# Altium schematic sheet ethernet.SchDoc
size A3
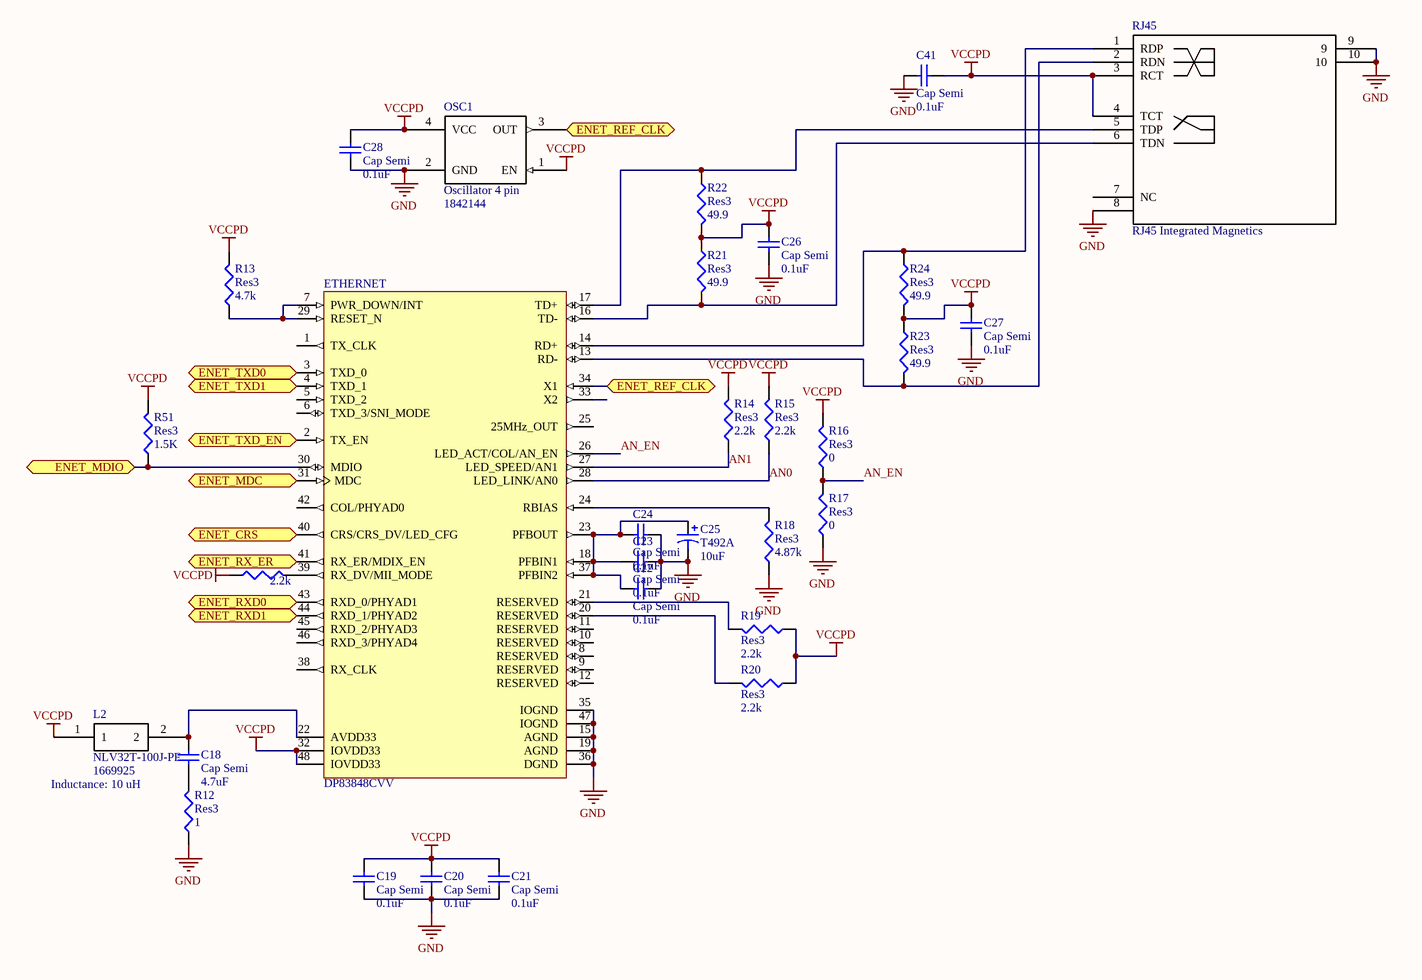
[diagram p0: ethernet.SchDoc]

## Parts
C18  Cap Semi  value 4.7uF  [CAPC1608L]
C19  Cap Semi  value 0.1uF  [CAPC1608L]
C20  Cap Semi  value 0.1uF  [CAPC1608L]
C21  Cap Semi  value 0.1uF  [CAPC1608L]
C22  Cap Semi  value 0.1uF  [CAPC1608L]
C23  Cap Semi  value 0.1uF  [CAPC1608L]
C24  Cap Semi  value 0.1uF  [CAPC1608L]
C25  T492A  value 10uF  [A]
C26  Cap Semi  value 0.1uF  [CAPC1608L]
C27  Cap Semi  value 0.1uF  [CAPC1608L]
C28  Cap Semi  value 0.1uF  [CAPC1608L]
C41  Cap Semi  value 0.1uF  [CAPC1608L]
ETHERNET  DP83848CVV  [VBH48A_N]
L2  NLV32T-100J-PF  Supplier Part Number 1: 1669925  Inductance: 10 uH  [INDC3225X22N]
OSC1  Oscillator 4 pin  Supplier Part Number 1: 1842144  [SMD Crystal 7x5 mm]
R12  Res3  value 1  [RESC1608L]
R13  Res3  value 4.7k  [RESC1608L]
R14  Res3  value 2.2k  [RESC1608L]
R15  Res3  value 2.2k  [RESC1608L]
R16  Res3  value 0  [RESC1608L]
R17  Res3  value 0  [RESC1608L]
R18  Res3  value 4.87k  [RESC1608L]
R19  Res3  value 2.2k  [RESC1608L]
R20  Res3  value 2.2k  [RESC1608L]
R21  Res3  value 49.9  [RESC1608L]
R22  Res3  value 49.9  [RESC1608L]
R23  Res3  value 49.9  [RESC1608L]
R24  Res3  value 49.9  [RESC1608L]
R33  value 2.2k  [RESC1608L]
R51  Res3  value 1.5K  [RESC1608L]
RJ45  RJ45 Integrated Magnetics  [RJ45]

## Ports
ENET_CRS, ENET_MDC, ENET_MDIO, ENET_REF_CLK, ENET_RX_ER, ENET_RXD0, ENET_RXD1, ENET_TXD0, ENET_TXD1, ENET_TXD_EN

## Nets
GND: C19.2 C20.2 C21.2 C22.2 C23.2 C24.2 C25.2 C26.1 C27.1 C28.2 C41.1 ETHERNET.15(AGND) ETHERNET.19(AGND) ETHERNET.35(IOGND) ETHERNET.36(DGND) ETHERNET.47(IOGND) OSC1.2(GND) R12.1 R17.1 R18.1 RJ45.8 RJ45.9 RJ45.10
VCCPD: C19.1 C20.1 C21.1 C26.2 C27.2 C28.1 C41.2 ETHERNET.32(IOVDD33) ETHERNET.48(IOVDD33) L2.1 OSC1.1(EN) OSC1.4(VCC) R13.2 R14.2 R15.2 R16.2 R19.1 R20.1 R21.1 R22.2 R23.1 R24.2 R33.1 R51.2 RJ45.3(RCT) RJ45.4(TCT)
AN0: ETHERNET.28(LED_LINK/AN0) R15.1
AN1: ETHERNET.27(LED_SPEED/AN1) R14.1
AN_EN: ETHERNET.26(LED_ACT/COL/AN_EN) R16.1 R17.2
ENET_CRS: ETHERNET.40(CRS/CRS_DV/LED_CFG) ; port ENET_CRS
ENET_MDC: ETHERNET.31(MDC) ; port ENET_MDC
ENET_MDIO: ETHERNET.30(MDIO) R51.1 ; port ENET_MDIO
ENET_REF_CLK: ETHERNET.34(X1) OSC1.3(OUT) ; port ENET_REF_CLK
ENET_RX_ER: ETHERNET.41(RX_ER/MDIX_EN) ; port ENET_RX_ER
ENET_RXD0: ETHERNET.43(RXD_0/PHYAD1) ; port ENET_RXD0
ENET_RXD1: ETHERNET.44(RXD_1/PHYAD2) ; port ENET_RXD1
ENET_TXD0: ETHERNET.3(TXD_0) ; port ENET_TXD0
ENET_TXD1: ETHERNET.4(TXD_1) ; port ENET_TXD1
ENET_TXD_EN: ETHERNET.2(TX_EN) ; port ENET_TXD_EN
NetC18_1: C18.1 ETHERNET.22(AVDD33) L2.2
NetC18_2: C18.2 R12.2
NetC22_1: C22.1 C23.1 C24.1 C25.1 ETHERNET.18(PFBIN1) ETHERNET.23(PFBOUT) ETHERNET.37(PFBIN2)
NetETHERNET_7: ETHERNET.7(PWR_DOWN/INT) ETHERNET.29(RESET_N) R13.1
NetETHERNET_13: ETHERNET.13(RD-) R23.2 RJ45.2(RDN)
NetETHERNET_14: ETHERNET.14(RD+) R24.1 RJ45.1(RDP)
NetETHERNET_16: ETHERNET.16(TD-) R21.2 RJ45.6(TDN)
NetETHERNET_17: ETHERNET.17(TD+) R22.1 RJ45.5(TDP)
NetETHERNET_20: ETHERNET.20(RESERVED) R20.2
NetETHERNET_21: ETHERNET.21(RESERVED) R19.2
NetETHERNET_24: ETHERNET.24(RBIAS) R18.2
NetETHERNET_39: ETHERNET.39(RX_DV/MII_MODE) R33.2

Not connected (* = marked no-connect by the designer): ETHERNET 1(TX_CLK) 5(TXD_2) 6(TXD_3/SNI_MODE) 8(RESERVED) 9(RESERVED) 10(RESERVED) 11(RESERVED) 12(RESERVED) 25(25MHz_OUT) 33(X2) 38(RX_CLK) 42(COL/PHYAD0) 45(RXD_2/PHYAD3) 46(RXD_3/PHYAD4); RJ45 7(NC)

## Library data of the parts
C18-C24 C26-C28 C41 = Cap Semi: Capacitor (Semiconductor SIM Model); Published: 8-Jun-2000; LatestRevisionDate: 29-May-2009; LatestRevisionNote: IPC-7351 Footprint Added.; PackageReference: C1206; Publisher: Altium Limited; PackageDescription: Chip Capacitor
C25 = T492A: Solid Tantalum Chip Capacitor, T492 Series - CWR11 Style Per Mil-PRF-55365/8; Published: 17-Jul-2002; LatestRevisionDate: 19-Mar-2004; LatestRevisionNote: Silkscreen dimensions re-sized.; DatasheetDocument: Mar-2001; PackageDocument: Mar-2001; PackageReference: A; Publisher: Altium Limited; Code_JEITA: 3216-18; ComponentLink1Description: Manufacturer Link; ComponentLink1URL: http://www.kemet.com/; ComponentLink2Description: Datasheet; ComponentLink2URL: http://www.kemet.com/kemet/web/homepage/kechome.nsf/vapubfilesname/F3102TA.pdf/$file/F3102TA.pdf
ETHERNET = DP83848CVV: PHYTER® Commercial Temperature Single Port 10/100 Mb/s Ethernet Physical Layer Transceiver; Manufacturer: National Semiconductor; CompType: Interface IC; PackageTopMarking: NSUZXYTT*DP83848VV*VBC; PowerWise: N; Published: 4-Dec-2008; DatasheetVersion: Feb-2007; PackageVersion: revE, May-2007; PackageReference: VBH48A; Publisher: Altium Limited; PackageDescription: LQFP, 7 x 7 x 1.4mm, 48 Lead, 0.5mm Pitch; PartNumber: DP83848CVV; RoHS: Y; PinCount: 48; DigiKeyPartNumber: DP83848CVV-ND; ComponentLink1Description: DP83848C Datasheet; ComponentLink1URL: http://www.national.com/ds/DP/DP83848C.pdf; ComponentLink2Description: DP83848C Web Page; ComponentLink2URL: http://www.national.com/pf/DP/DP83848C.html; ComponentLink3Description: VBH48A Package Page; ComponentLink3URL: http://www.national.com/packaging/folders/vbh48a.html
L2 = NLV32T-100J-PF: Current rating: 150 mA; Supplier 1: Farnell
R12-R24 R33 R51 = Res3: Resistor; Published: 8-Jun-2000; LatestRevisionDate: 29-May-2009; LatestRevisionNote: IPC-7351 Footprint Added.; PackageReference: J1-0603; Publisher: Altium Limited; PackageDescription: Chip Resistor
OSC1 = Oscillator 4 pin: Supplier 1: Farnell